# Altium project ballast2.PrjPCB
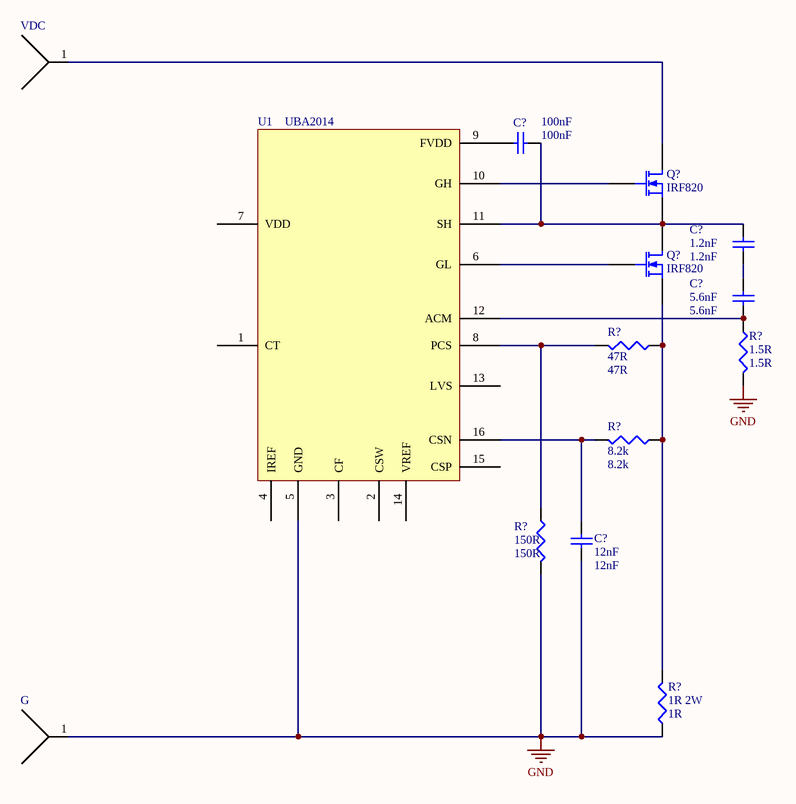
[diagram p0: ballast2.SchDoc]
1 sheet, 14 parts. Net scope: global (net labels, ports and power ports of the same name join across sheets).

## Sheet ballast2.SchDoc
size A4

### Parts
(Parts that share a designator on the sheet are numbered #1, #2 ... from top to bottom, then left to right.)
C?#1  100nF  [C1206]
C?#2  1.2nF  [C1206]
C?#3  5.6nF  [C1206]
C?#4  12nF  [C1206]
G  (no value)
Q?#1  IRF820  [E3]
Q?#2  IRF820  [E3]
R?#1  1.5R  [J1-0603]
R?#2  47R  [J1-0603]
R?#3  8.2k  [J1-0603]
R?#4  150R  [J1-0603]
R?#5  1R 2W  value 1R  [J1-0603]
U1  UBA2014
VDC  (no value)

### Nets
GND: C?#4.2 G.1 R?#1.2 R?#4.2 R?#5.1 U1.5(GND)
NetC?#1_1: C?#1.1 C?#2.1 Q?#1.3(S) Q?#2.1(D) U1.11(SH)
NetC?#1_2: C?#1.2 U1.9(FVDD)
NetC?#2_2: C?#2.2 C?#3.1
NetC?#3_2: C?#3.2 R?#1.1 U1.12(ACM)
NetC?#4_1: C?#4.1 R?#3.2 U1.16(CSN)
NetQ?#1_1: Q?#1.1(D) VDC.1
NetQ?#1_2: Q?#1.2(G) U1.10(GH)
NetQ?#2_2: Q?#2.2(G) U1.6(GL)
NetQ?#2_3: Q?#2.3(S) R?#2.1 R?#3.1 R?#5.2
NetR?#2_2: R?#2.2 R?#4.1 U1.8(PCS)

Not connected (* = marked no-connect by the designer): U1 1(CT) 2(CSW) 3(CF) 4(IREF) 7(VDD) 13(LVS) 14(VREF) 15(CSP)

### Library data of the parts
C?#1-C?#4 = Cap Semi: Capacitor (Semiconductor SIM Model); Published: 8-Jun-2000; LatestRevisionDate: 29-May-2009; LatestRevisionNote: IPC-7351 Footprint Added.; PackageReference: C1206; Publisher: Altium Limited; PackageDescription: Chip Capacitor
  C?#1: Value: 100nF
  C?#2: Value: 1.2nF
  C?#3: Value: 5.6nF
  C?#4: Value: 12nF
G VDC = PWRCON
Q?#1 Q?#2 = MOSFET-N: N-Channel MOSFET; Published: 8-Jun-2000; LatestRevisionDate: 17-Jul-2002; LatestRevisionNote: Re-released for DXP Platform.; PackageVersion: 1995/1996; PackageReference: E3; Publisher: Altium Limited; PackageDescription: TO, Flat Index; 3 In-Line, Axial Leads; Body Dia. 4.6mm; Lead Dia. 0.5 mm (max)
R?#1-R?#5 = Res3: Resistor; Published: 8-Jun-2000; LatestRevisionDate: 29-May-2009; LatestRevisionNote: IPC-7351 Footprint Added.; PackageReference: J1-0603; Publisher: Altium Limited; PackageDescription: Chip Resistor
  R?#1: Value: 1.5R
  R?#2: Value: 47R
  R?#3: Value: 8.2k
  R?#4: Value: 150R